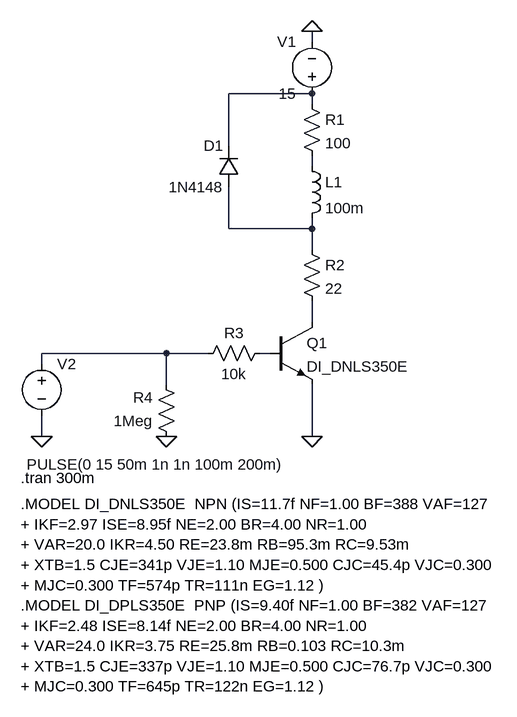
[diagram p0: schematic relay.asc]
relay.asc, the LTspice schematic file:
Version 4
SHEET 1 1264 916
WIRE 256 -80 256 -96
WIRE 256 0 128 0
WIRE 256 16 256 0
WIRE 128 80 128 0
WIRE 256 112 256 96
WIRE 128 208 128 144
WIRE 256 208 256 192
WIRE 256 208 128 208
WIRE 256 240 256 208
WIRE 256 352 256 320
WIRE 32 400 -160 400
WIRE 96 400 32 400
WIRE 192 400 176 400
WIRE -160 416 -160 400
WIRE 32 448 32 400
WIRE -160 528 -160 496
WIRE 256 528 256 448
FLAG 32 528 0
FLAG 256 -96 0
FLAG 256 528 0
FLAG -160 528 0
SYMBOL diode 144 144 R180
WINDOW 0 24 64 Left 2
WINDOW 3 24 0 Left 2
SYMATTR InstName D1
SYMATTR Value 1N4148
SYMBOL res 240 0 R0
SYMATTR InstName R1
SYMATTR Value 100
SYMBOL ind 240 96 R0
SYMATTR InstName L1
SYMATTR Value 100m
SYMBOL res 240 224 R0
SYMATTR InstName R2
SYMATTR Value 22
SYMBOL res 80 416 R270
WINDOW 0 32 56 VTop 2
WINDOW 3 0 56 VBottom 2
SYMATTR InstName R3
SYMATTR Value 10k
SYMBOL res 48 544 R180
WINDOW 0 36 76 Left 2
WINDOW 3 36 40 Left 2
SYMATTR InstName R4
SYMATTR Value 1Meg
SYMBOL voltage 256 16 R180
WINDOW 0 24 96 Left 2
WINDOW 3 24 16 Left 2
WINDOW 123 0 0 Left 0
WINDOW 39 0 0 Left 0
SYMATTR InstName V1
SYMATTR Value 15
SYMBOL npn 192 352 R0
SYMATTR InstName Q1
SYMATTR Value DI_DNLS350E
SYMBOL voltage -160 400 R0
WINDOW 3 -23 171 Left 2
WINDOW 123 0 0 Left 0
WINDOW 39 0 0 Left 0
SYMATTR InstName V2
SYMATTR Value PULSE(0 15 50m 1n 1n 100m 200m)
TEXT -192 632 Left 2 !.MODEL DI_DNLS350E  NPN (IS=11.7f NF=1.00 BF=388 VAF=127\n+ IKF=2.97 ISE=8.95f NE=2.00 BR=4.00 NR=1.00\n+ VAR=20.0 IKR=4.50 RE=23.8m RB=95.3m RC=9.53m\n+ XTB=1.5 CJE=341p VJE=1.10 MJE=0.500 CJC=45.4p VJC=0.300\n+ MJC=0.300 TF=574p TR=111n EG=1.12 )\n.MODEL DI_DPLS350E  PNP (IS=9.40f NF=1.00 BF=382 VAF=127\n+ IKF=2.48 ISE=8.14f NE=2.00 BR=4.00 NR=1.00\n+ VAR=24.0 IKR=3.75 RE=25.8m RB=0.103 RC=10.3m\n+ XTB=1.5 CJE=337p VJE=1.10 MJE=0.500 CJC=76.7p VJC=0.300\n+ MJC=0.300 TF=645p TR=122n EG=1.12 )
TEXT -192 592 Left 2 !.tran 300m

The netlist it stands for:
* relay.asc
D1 N003 N001 1N4148
R1 N001 N002 100
L1 N002 N003 100m
R2 N003 N004 22
R3 N005 N006 10k
R4 0 N005 1Meg
V1 N001 0 15
Q1 N004 N006 0 0 DI_DNLS350E
V2 N005 0 PULSE(0 15 50m 1n 1n 100m 200m)
.model D D
.lib standard.dio
.model NPN NPN
.model PNP PNP
.lib standard.bjt
.MODEL DI_DNLS350E  NPN (IS=11.7f NF=1.00 BF=388 VAF=127
+ IKF=2.97 ISE=8.95f NE=2.00 BR=4.00 NR=1.00
+ VAR=20.0 IKR=4.50 RE=23.8m RB=95.3m RC=9.53m
+ XTB=1.5 CJE=341p VJE=1.10 MJE=0.500 CJC=45.4p VJC=0.300
+ MJC=0.300 TF=574p TR=111n EG=1.12 )
.MODEL DI_DPLS350E  PNP (IS=9.40f NF=1.00 BF=382 VAF=127
+ IKF=2.48 ISE=8.14f NE=2.00 BR=4.00 NR=1.00
+ VAR=24.0 IKR=3.75 RE=25.8m RB=0.103 RC=10.3m
+ XTB=1.5 CJE=337p VJE=1.10 MJE=0.500 CJC=76.7p VJC=0.300
+ MJC=0.300 TF=645p TR=122n EG=1.12 )
.tran 300m
.backanno
.end